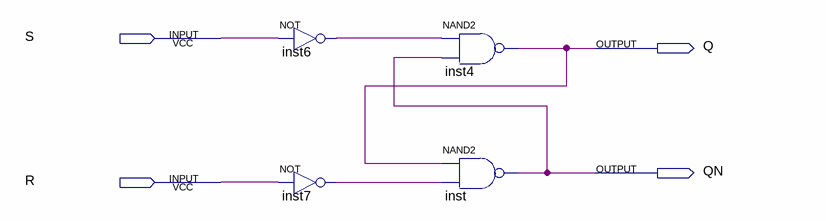
[diagram p0: schematic sheet]
// Quartus schematic lab9step1b.bdf as structural Verilog: 4 symbols, 4 pins
module lab9step1b (
  input  S,
  input  R,
  output Q,
  output QN
);

  wire inst6_out, inst7_out;

  not inst6 (inst6_out, S);
  not inst7 (inst7_out, R);
  nand inst4 (Q, inst6_out, QN);
  nand inst (QN, Q, inst7_out);
endmodule
